# Altium schematic sheet Connectors.SchDoc: Connectors
size A4; DocumentNumber: 6; SheetNumber: 6; SheetTotal: 8
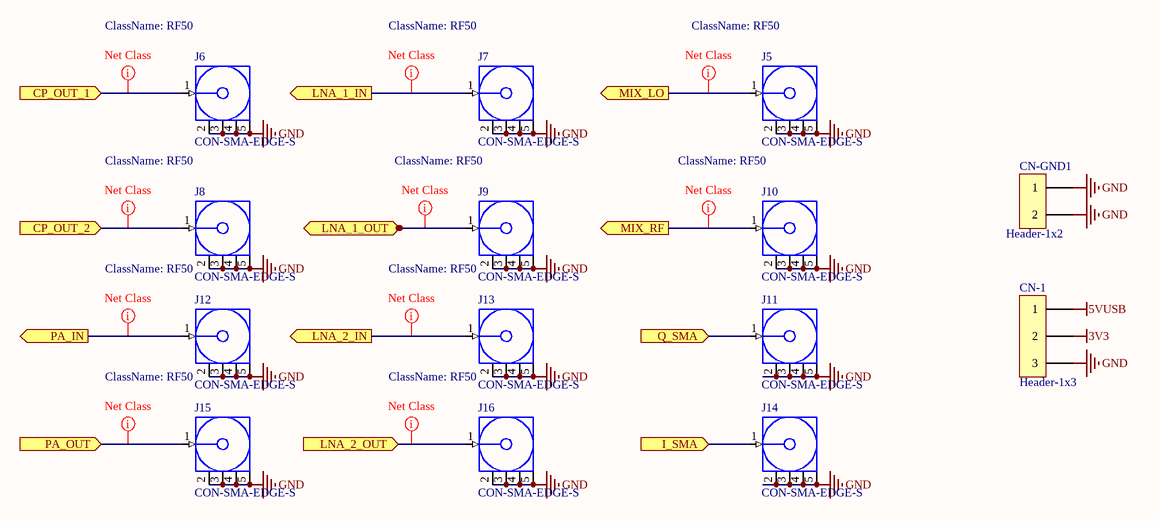
[diagram p0: Connectors.SchDoc]

## Parts
CN-1  Header-1x3  [Header-1x3-Jumper]
CN-GND1  Header-1x2  [HEADER-1x2-Jumper]
J5  CON-SMA-EDGE-S  [CON-SMA-EDGE-S]
J6  CON-SMA-EDGE-S  [CON-SMA-EDGE-S]
J7  CON-SMA-EDGE-S  [CON-SMA-EDGE-S]
J8  CON-SMA-EDGE-S  [CON-SMA-EDGE-S]
J9  CON-SMA-EDGE-S  [CON-SMA-EDGE-S]
J10  CON-SMA-EDGE-S  [CON-SMA-EDGE-S]
J11  CON-SMA-EDGE-S  [CON-SMA-EDGE-S]
J12  CON-SMA-EDGE-S  [CON-SMA-EDGE-S]
J13  CON-SMA-EDGE-S  [CON-SMA-EDGE-S]
J14  CON-SMA-EDGE-S  [CON-SMA-EDGE-S]
J15  CON-SMA-EDGE-S  [CON-SMA-EDGE-S]
J16  CON-SMA-EDGE-S  [CON-SMA-EDGE-S]

## Ports
CP_OUT_1 (in), CP_OUT_2 (in), I_SMA (in), LNA_1_IN (out), LNA_1_OUT (in), LNA_2_IN (out), LNA_2_OUT (in), MIX_LO (out), MIX_RF (out), PA_IN (out), PA_OUT (in), Q_SMA (in)

## Nets
3V3: CN-1.2
5VUSB: CN-1.1
GND: CN-1.3 CN-GND1.1 CN-GND1.2 J5.2(GND) J5.3(GND) J5.4(GND) J5.5(GND) J6.2(GND) J6.3(GND) J6.4(GND) J6.5(GND) J7.2(GND) J7.3(GND) J7.4(GND) J7.5(GND) J8.2(GND) J8.3(GND) J8.4(GND) J8.5(GND) J9.2(GND) J9.3(GND) J9.4(GND) J9.5(GND) J10.2(GND) J10.3(GND) J10.4(GND) J10.5(GND) J11.2(GND) J11.3(GND) J11.4(GND) J11.5(GND) J12.2(GND) J12.3(GND) J12.4(GND) J12.5(GND) J13.2(GND) J13.3(GND) J13.4(GND) J13.5(GND) J14.2(GND) J14.3(GND) J14.4(GND) J14.5(GND) J15.2(GND) J15.3(GND) J15.4(GND) J15.5(GND) J16.2(GND) J16.3(GND) J16.4(GND) J16.5(GND)
CP_OUT_1: J6.1(Signal) ; port CP_OUT_1
CP_OUT_2: J8.1(Signal) ; port CP_OUT_2
I_SMA: J14.1(Signal) ; port I_SMA
LNA_1_IN: J7.1(Signal) ; port LNA_1_IN
LNA_1_OUT: J9.1(Signal) ; port LNA_1_OUT
LNA_2_IN: J13.1(Signal) ; port LNA_2_IN
LNA_2_OUT: J16.1(Signal) ; port LNA_2_OUT
MIX_LO: J5.1(Signal) ; port MIX_LO
MIX_RF: J10.1(Signal) ; port MIX_RF
PA_IN: J12.1(Signal) ; port PA_IN
PA_OUT: J15.1(Signal) ; port PA_OUT
Q_SMA: J11.1(Signal) ; port Q_SMA

## Layout directives
net class RF50: CP_OUT_1, CP_OUT_2, LNA_1_IN, LNA_1_OUT, LNA_2_IN, LNA_2_OUT, MIX_LO, MIX_RF, PA_IN, PA_OUT

## Notes on the sheet
- Title
- Size:
- A4
- Number:
- Revision:
- Date:
- Sheet
- of

## Library data of the parts
J5-J16 = CON-SMA-EDGE-S: CONN SMA JACK STR EDGE MNT; Manufacturer: RF Solutions; Connector Type: Jack, Female Socket; Contact Termination: Solder; Supplier 1: Digi-Key; Manufacturer Part Number: CON-SMA-EDGE-S; RoHS: RoHS Compliant; Category: Connectors, Interconnects; Stock 1: 0; Pricing 1: 1=1.51 (EUR); Packaging: -; Part Status: Active; Connector Style: SMA; Shield Termination: Solder; Impedance: -; Mounting Type: Board Edge, End Launch; Mounting Feature: -; Cable Group: -; Fastening Type: Threaded; Features: -; Housing Color: -; Ingress Protection: -; Includes: -; Body Material: -; Body Finish: -; Center Contact Plating: -; Dielectric Material: -; Operating Temperature: -; Center Contact Material: -; Mating Cycles: -; Insertion Loss: -; ComponentLink1URL: https://media.digikey.com/pdf/Data%20Sheets/RF%20Solutions%20PDFs/CON-SMA-EDGE.pdf; ComponentLink1Description: https://media.digikey.com/pdf/Data%20Sheets/RF%20Solutions%20PDFs/CON-SMA-EDGE.pdf; Supplier Part Number 1: CON-SMA-EDGE-S-ND